# EAGLE schematic lcd_et_rotary (EAGLE 6.5.0)
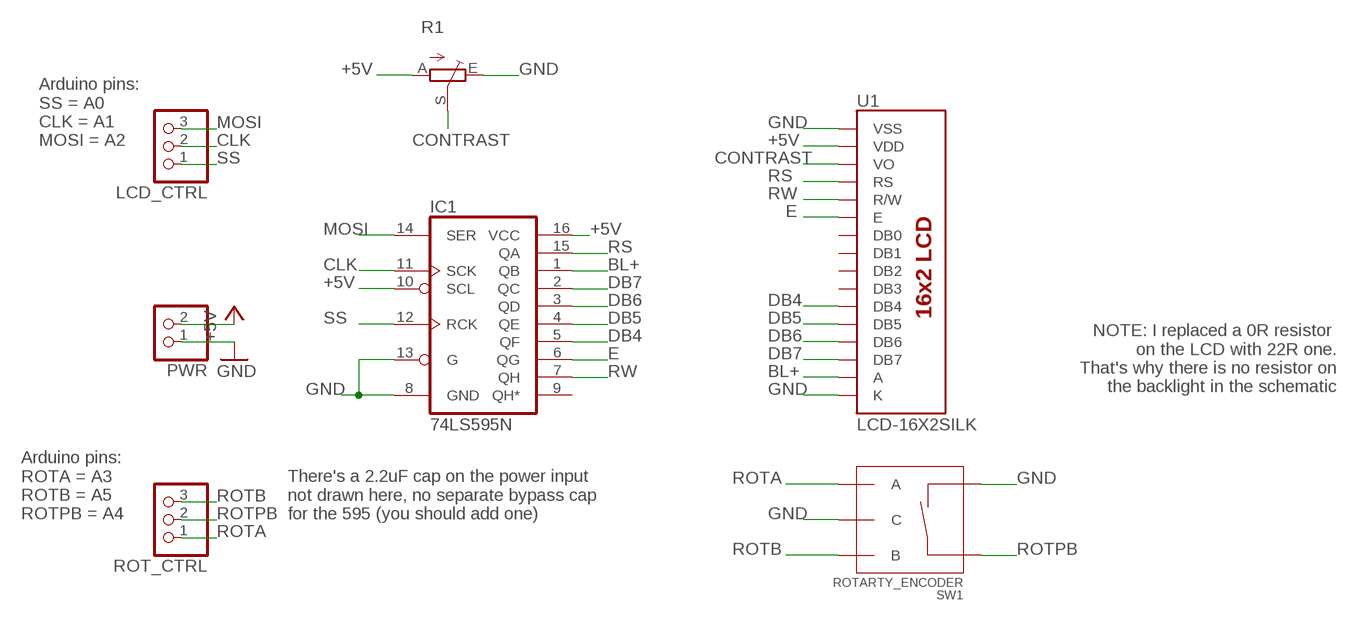
[diagram p0: schematic, sheet 1]

## Parts
IC1  74LS595N  [DIL16]
LCD_CTRL  PINHD-1X3  [1X03]
PWR  PINHD-1X2  [1X02]
R1  TRIM_EU-S64W  [S64W]
ROT_CTRL  PINHD-1X3  [1X03]
SW1  ROTARTY_ENCODER  [ROTARY_ENC_PLAIN]
U1  LCD-16X2SILK  [LCD-16X2]

## Nets
+5V: IC1.10(SCL) IC1.16(VCC) PWR.2 R1.A U1.2(VDD)
BL+: IC1.1(QB) U1.15(A)
CLK: IC1.11(SCK) LCD_CTRL.2
CONTRAST: R1.S U1.3(VO)
DB4: IC1.5(QF) U1.11(DB4)
DB5: IC1.4(QE) U1.12(DB5)
DB6: IC1.3(QD) U1.13(DB6)
DB7: IC1.2(QC) U1.14(DB7)
E: IC1.6(QG) U1.6(E)
GND: IC1.8(GND) IC1.13(G) PWR.1 R1.E SW1.C SW1.SW- U1.1(VSS) U1.16(K)
MOSI: IC1.14(SER) LCD_CTRL.3
ROTA: ROT_CTRL.1 SW1.A
ROTB: ROT_CTRL.3 SW1.B
ROTPB: ROT_CTRL.2 SW1.SW+
RS: IC1.15(QA) U1.4(RS)
RW: IC1.7(QH) U1.5(R/W)
SS: IC1.12(RCK) LCD_CTRL.1
Unconnected: IC1.9(QH*) U1.7(DB0) U1.8(DB1) U1.9(DB2) U1.10(DB3)

## Notes on the sheet
- Arduino pins:
  SS = A0
  CLK = A1
  MOSI = A2
- NOTE: I replaced a 0R resistor 
  on the LCD with 22R one.
  That's why there is no resistor on
  the backlight in the schematic
- Arduino pins:
  ROTA = A3
  ROTB = A5
  ROTPB = A4
- There's a 2.2uF cap on the power input
  not drawn here, no separate bypass cap
  for the 595 (you should add one)

## Library data of the parts
IC1 = SparkFun-DigitalIC:74*595: 8-bit SHIFT REGISTER, output latch
LCD_CTRL ROT_CTRL = pinhead:PINHD-1X3: PIN HEADER
PWR = pinhead:PINHD-1X2: PIN HEADER
R1 = pot:TRIM_EU-: POTENTIOMETER
SW1 = SparkFun-Electromechanical:ROTARTY_ENCODER: Simple no LED rotary encoder Example: COM-09117
U1 = SparkFun-Displays:LCD-16X2: Standard text-only 16x2 parallel input LCD